# EAGLE schematic ble112_breakout_board_v20 (EAGLE 7.7.0)
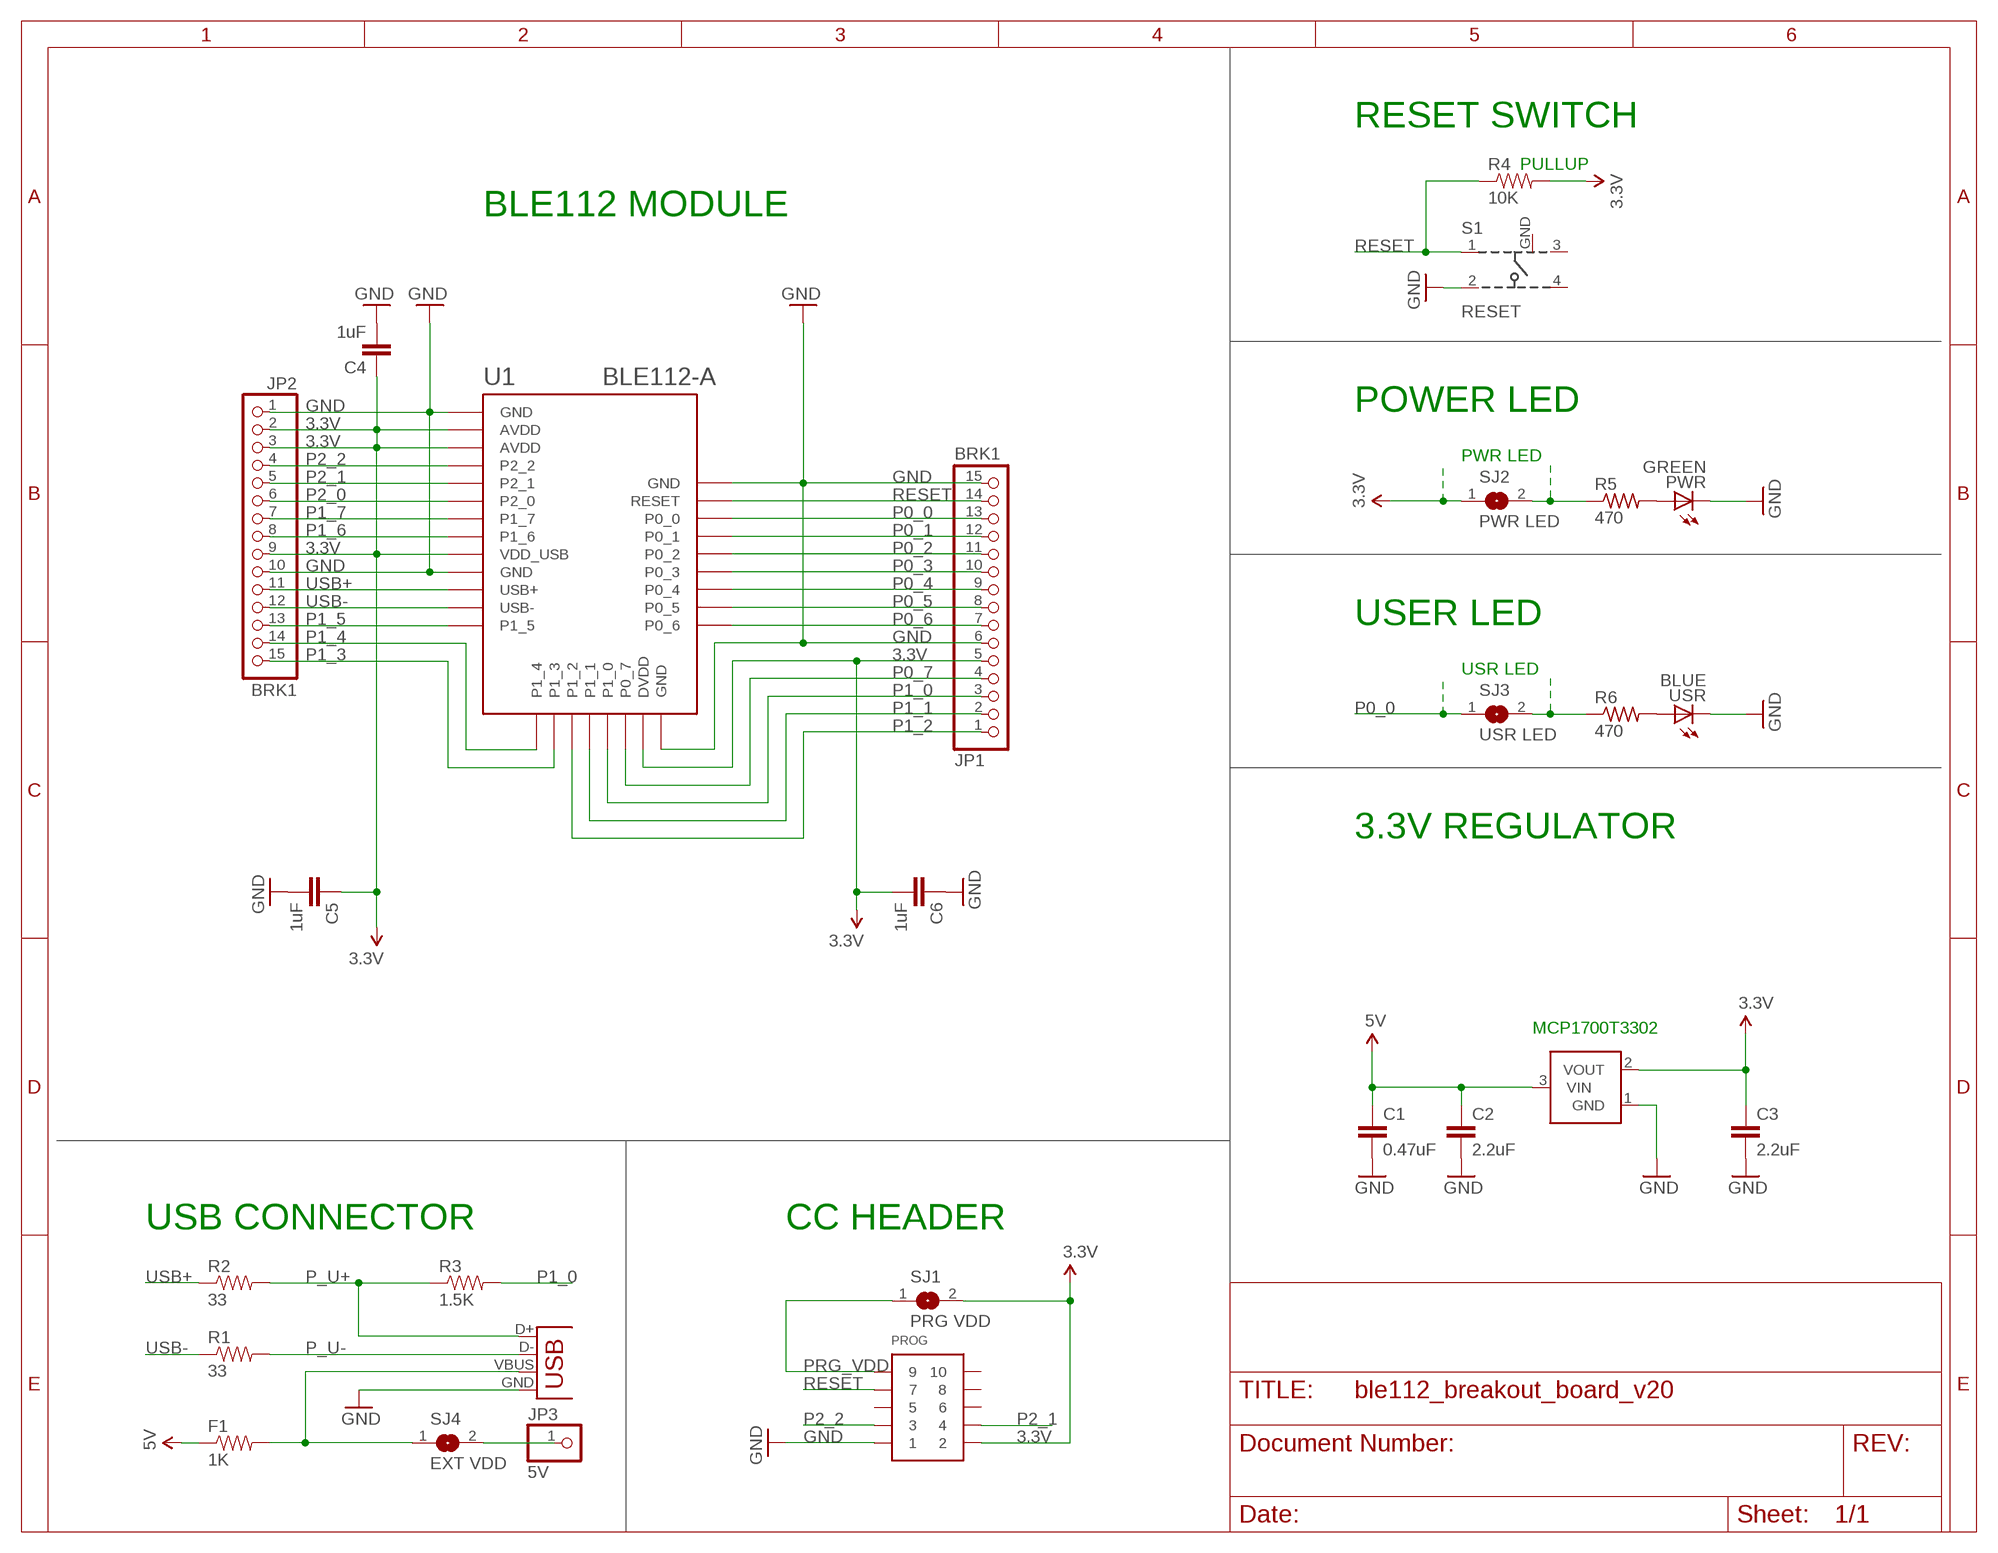
[diagram p0: schematic, sheet 1]

## Parts
C1  0.47uF  CAP0603-CAP  [0603-CAP]
C2  2.2uF  CAP0603-CAP  [0603-CAP]
C3  2.2uF  CAP0603-CAP  [0603-CAP]
C4  1uF  CAP0603-CAP  [0603-CAP]
C5  1uF  CAP0603-CAP  [0603-CAP]
C6  1uF  CAP0603-CAP  [0603-CAP]
F1  1K  RESISTOR0805-RES  [0805]
JP1  BRK1  PINHD-1X15  [1X15]
JP2  BRK1  PINHD-1X15  [1X15]
JP3  5V  PINHD-1X1  [1X01]
PROG  CONN_5-2-FTSH-V  [FTSH-105-DV]
PWR  GREEN  LEDCHIPLED_0805  [CHIPLED_0805]
R1  33  RESISTOR0603-RES  [0603-RES]
R2  33  RESISTOR0603-RES  [0603-RES]
R3  1.5K  RESISTOR0603-RES  [0603-RES]
R4  10K  RESISTOR0603-RES  [0603-RES]
R5  470  R-US_R0603  [R0603]
R6  470  R-US_R0603  [R0603]
S1  RESET  101-IG  [101-IG]
SJ1  PRG VDD  SJ  [SJ]
SJ2  PWR LED  SJ  [SJ]
SJ3  USR LED  SJ  [SJ]
SJ4  EXT VDD  SJ  [SJ]
U1  BLE112-A  BLE112-A-VISUAL  [BLE112-A]
U2  MCP1700  [SOT23-3]
USB  USB-MICROB  [USB-MICROB]
USR  BLUE  LEDCHIPLED_0805  [CHIPLED_0805]

## Nets
3.3V [power]: C3.1 C4.1 C5.1 C6.2 JP1.5 JP2.2 JP2.3 JP2.9 PROG.2 R4.2 SJ1.2 SJ2.1 U1.AVDD1(AVDD) U1.AVDD2(AVDD) U1.DVDD U1.VDD_USB U2.2(VOUT)
5V [power]: C1.1 C2.1 F1.1 U2.3(VIN)
GND [power]: C1.2 C2.2 C3.2 C4.2 C5.2 C6.1 JP1.6 JP1.15 JP2.1 JP2.10 PROG.1 PWR.C S1.2 U1.GND1(GND) U1.GND2(GND) U1.GND3(GND) U1.GND4(GND) U2.1(GND) USB.GND USR.C
N$1: PWR.A R5.2
N$3 [power]: R5.1 SJ2.2
N$4: R6.2 USR.A
N$5: R6.1 SJ3.2
N$7 [power]: JP3.1 SJ4.2
P0_0: JP1.13 SJ3.1 U1.P0_0
P0_1: JP1.12 U1.P0_1
P0_2: JP1.11 U1.P0_2
P0_3: JP1.10 U1.P0_3
P0_4: JP1.9 U1.P0_4
P0_5: JP1.8 U1.P0_5
P0_6: JP1.7 U1.P0_6
P0_7: JP1.4 U1.P0_7
P1_0: JP1.3 R3.2 U1.P1_0
P1_1: JP1.2 U1.P1_1
P1_2: JP1.1 U1.P1_2
P1_3: JP2.15 U1.P1_3
P1_4: JP2.14 U1.P1_4
P1_5: JP2.13 U1.P1_5
P1_6: JP2.8 U1.P1_6
P1_7: JP2.7 U1.P1_7
P2_0: JP2.6 U1.P2_0
P2_1: JP2.5 PROG.4 U1.P2_1
P2_2: JP2.4 PROG.3 U1.P2_2
P_U+: R2.2 R3.1 USB.D+
P_U-: R1.2 USB.D-
PRG_VDD [power]: PROG.9 SJ1.1
RESET: JP1.14 PROG.7 R4.1 S1.1 U1.RESET
USB+: JP2.11 R2.1 U1.USB+
USB-: JP2.12 R1.1 U1.USB-
VBUS [power]: F1.2 SJ4.1 USB.VBUS
Unconnected: PROG.5 PROG.6 PROG.8 PROG.10 S1.3 S1.4

## Notes on the sheet
- RESET SWITCH
- PULLUP
- BLE112 MODULE
- POWER LED
- PWR LED
- USER LED
- USR LED
- 3.3V REGULATOR
- MCP1700T3302
- USB CONNECTOR | CC HEADER

## Power pins joined to a net without a drawn wire
GND: S1.GND

## Library data of the parts
C1-C6 = SparkFun:CAP: Capacitor Standard 0603 ceramic capacitor, and 0.1" leaded capacitor.
F1 R1-R4 = SparkFun:RESISTOR: Resistor Basic schematic elements and footprints for 0603, 1206, and PTH resistors.
JP1 JP2 = sf-pinhead:PINHD-1X15: PIN HEADER
JP3 = adafruit:PINHD-1X1: Pin header 1x1 for 0.1" spacing With round pins
PROG = pel_misc:CONN_5-2
PWR USR = led:LED: LED OSRAM: - CHIPLED LG R971, LG N971, LY N971, LG Q971, LY Q971, LO R971, LY R971 LH N974, LH R974 LS Q976, LO Q976, LY Q976 LO Q996 - Hyper CHIPLED LW Q18S LB Q993, LB Q99A, LB R99A - SideLED LS A670, LO A670, LY A670, LG A670, LP A670 LB A673, LV A673, LT A673, LW A673 LH A674 LY A675 LS A676, LA A676, LO A676, LY A676, LW A676 LS A679, LY A679, LG A679 - Hyper Micro SIDELED® LS Y876, LA Y876, LO Y876, LY Y876 LT Y87S - SmartLED LW L88C, LW L88S LB L89C, LB L89S, LG L890 LS L89K, LO L89K, LY L89K LS L896, LA L896, LO L896, LY L896 - TOPLED LS T670, LO T670, LY T670, LG T670, LP T670 LSG T670, LSP T670, LSY T670, LOP T670, LYG T670 LG T671, LOG T671, LSG T671 LB T673, LV T673, LT T673, LW T673 LH T674 LS T676, LA T676, LO T676, LY T676, LB T676, LH T676, LSB T676, LW T676 LB T67C, LV T67C, LT T67C, LS T67K, LO T67K, LY T67K, LW E67C LS E67B, LA E67B, LO E67B, LY E67B, LB E67C, LV E67C, LT E67C LW T67C LS T679, LY T679, LG T679 LS T770, LO T770, LY T770, LG T770, LP T770 LB T773, LV T773, LT T773, LW T773 LH T774 LS E675, LA E675, LY E675, LS T675 LS T776, LA T776, LO T776, LY T776, LB T776 LHGB T686 LT T68C, LB T68C - Hyper Mini TOPLED® LB M676 - Mini TOPLED Santana® LG M470 LS M47K, LO M47K, LY M47K Source: http://www.osram.convergy.de LUXEON: - LUMILED® LXK2-PW12-R00, LXK2-PW12-S00, LXK2-PW14-U00, LXK2-PW14-V00 LXK2-PM12-R00, LXK2-PM12-S00, LXK2-PM14-U00 LXK2-PE12-Q00, LXK2-PE12-R00, LXK2-PE12-S00, LXK2-PE14-T00, LXK2-PE14-U00 LXK2-PB12-K00, LXK2-PB12-L00, LXK2-PB12-M00, LXK2-PB14-N00, LXK2-PB14-P00, LXK2-PB14-Q00 LXK2-PR12-L00, LXK2-PR12-M00, LXK2-PR14-Q00, LXK2-PR14-R00 LXK2-PD12-Q00, LXK2-PD12-R00, LXK2-PD12-S00 LXK2-PH12-R00, LXK2-PH12-S00 LXK2-PL12-P00, LXK2-PL12-Q00, LXK2-PL12-R00 Source: www.luxeon.com KINGBRIGHT: KA-3528ASYC Source: www.kingbright.com
R5 R6 = resistor:R-US_: RESISTOR, American symbol
S1 = sf-keyglove:101-IG
SJ1-SJ4 = jumper:SJ: SMD solder JUMPER
U1 = sf-bluegiga:BLE112-A-VISUAL: Bluetooth Low Energy single-mode module - Bluetooth 4.0, chip antenna
U2 = nonolith:MCP1700: Voltage regulator
USB = SparkFun:USB: USB Connectors USB-B-PTH is fully proven SKU : PRT-00139 USB-miniB is fully proven SKU : PRT-00587 USB-A-PCB is untested. USB-A-H is throughly reviewed, but untested. Spark Fun Electronics SKU : PRT-00437 USB-B-SMT is throughly reviewed, but untested. Needs silkscreen touching up. USB-A-S has not been used/tested USB-MB-H has not been used/tested

## Net classes
0 default: width 0.152 mm, drill 0.33 mm, clearance 0.152 mm
1 power: width 0.254 mm, drill 0.33 mm, clearance 0.152 mm